# Altium schematic sheet Sheet1.SchDoc
size A
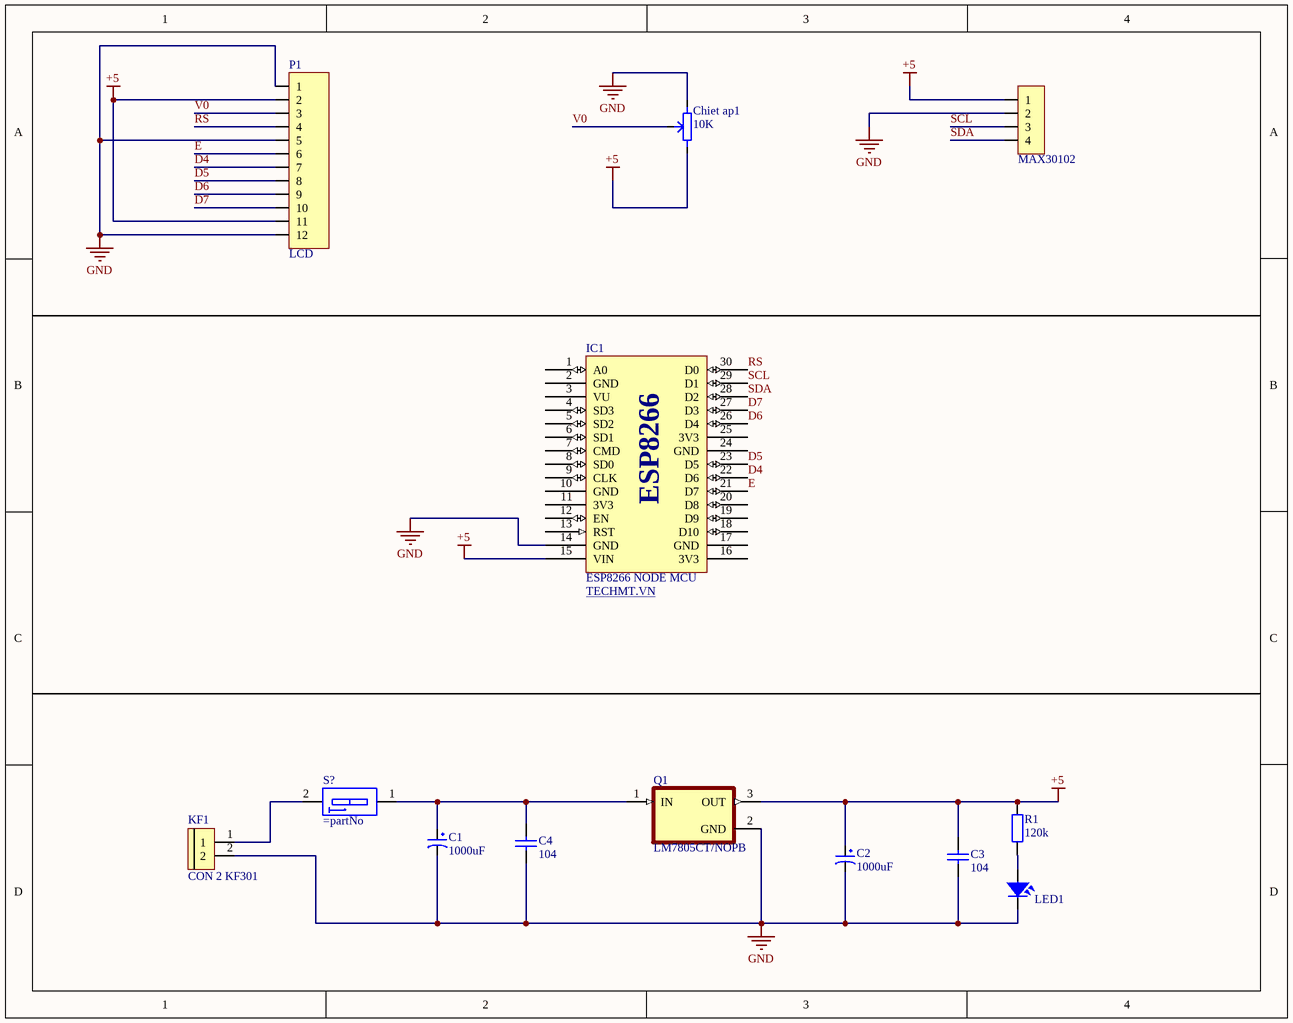
[diagram p0: Sheet1.SchDoc]

## Parts
C1  1000uF  [tu hoa 8mm]
C2  1000uF  [tu hoa 8mm]
C3  104  [tu gom]
C4  104  [tu gom]
Chiet_ap1  10K  [Bien Tro Tam Giac Dung]
IC1  ESP8266 NODE MCU  WEB: TECHMT.VN  [ESP8266 NodeMCU]
JP1  MAX30102  [JP 1x4 DT]
KF1  CON 2 KF301  [Con 2 KF301 5.08]
LED1  LED  [LED-3MM-YELLOW]  (value not drawn)
P1  LCD  [HDR/Header/12]
Q1  LM7805CT/NOPB  [TO254P1054X470X2600-3]
R1  120k  [tro vach 1/4w]
S?  (no value)  [SW-DIP1]

## Nets
+5: C2.1 C3.1 Chiet_ap1.1 IC1.15(VIN) JP1.1 P1.2 P1.11 Q1.3(OUT) R1.2
GND: C1.2 C2.2 C3.2 C4.2 Chiet_ap1.3 IC1.14(GND) JP1.2 KF1.2 LED1.2 P1.1 P1.5 P1.12 Q1.2(GND)
D4: IC1.22(D6) P1.7
D5: IC1.23(D5) P1.8
D6: IC1.26(D4) P1.9
D7: IC1.27(D3) P1.10
E: IC1.21(D7) P1.6
RS: IC1.30(D0) P1.4
SCL: IC1.29(D1) JP1.3
SDA: IC1.28(D2) JP1.4
V0: Chiet_ap1.2 P1.3
NetC1_1: C1.1 C4.1 Q1.1(IN) S?.1
NetKF1_1: KF1.1 S?.2
NetLED1_1: LED1.1 R1.1

Not connected (* = marked no-connect by the designer): IC1 1(A0) 2(GND) 3(VU) 4(SD3) 5(SD2) 6(SD1) 7(CMD) 8(SD0) 9(CLK) 10(GND) 11(3V3) 12(EN) 13(RST) 16(3V3) 17(GND) 18(D10) 19(D9) 20(D8) 24(GND) 25(3V3)

## Notes on the sheet
- (in symbol ESP8266 NodeMCU) ESP8266

## Library data of the parts
C1 C2 = Tu Hoa 1000uF 16V 8x20: Cắm; Don_Vi: Con; So_Chan: 2; Ten_Linh_Kien: Tụ Hóa 1000uF 16V 8x20MM; Ma_Hang: MH008300; Chung_Loai: Cắm; Kieu_Chan: *
C3 C4 = Tu gom 104 50V: Cắm; So_Chan: 2; Ten_Linh_Kien: Tụ gốm 104 100nF 50V; Don_Vi: Con; Ma_Hang: MH004761; Chung_Loai: Cắm; Kieu_Chan: *
Chiet_ap1 = Bien tro tam giac 10K Dung: Cắm; Ma_Hang: MH000919; Don_Vi: Con; Ten_Linh_Kien: Biến Trở Tam Giác 103-10K RM065 (Chân Đứng); Chung_Loai: Cắm; Kieu_Chan: *
IC1 = ESP8266 NodeMCU: LUA-ESP8266 Wifi Module Techmt.vn
JP1 = JP 1x4 2.54 Duc Thang: Cắm; Ten_Linh_Kien: Jump Đơn Đực 2.54MM 1x40P Thẳng 11MM; Don_Vi: Con; Ma_Hang: MH000903; Ghi_Chu: *; Kieu_Chan: *; Chung_Loai: Cắm
KF1 = CON 2 KF301: Cắm; Ma_Hang: MH000987; Ten_Linh_Kien: CON 2 KF301-2P 5.08MM Xanh Dương; Chung_Loai: Cắm; Ghi_Chu: *; Kieu_Chan: *; Don_Vi: Con
LED1 = LED: LED Single colour Green and Red; Value: LED 3 ly Single Colour
P1 = Header 12: Header, 12-Pin
Q1 = LM7805CT/NOPB: Linear Voltage Regulator IC Positive Fixed 1 Output 1.5A TO-220-3; MF: ON Semiconductor; Purchase-URL: https://pricing.snapeda.com/search/part/LM7805CT/?ref=eda; Check_prices: https://www.snapeda.com/parts/LM7805CT/Onsemi/view-part/?ref=eda; SnapEDA_Link: https://www.snapeda.com/parts/LM7805CT/Onsemi/view-part/?ref=snap; Price: None; Availability: In Stock; Package: TO-220-3 ON Semiconductor; MP: LM7805CT; Value: *
R1 = Tro Vach 1/4W 1%  120k: Cắm; Don_Vi: Con; Ten_Linh_Kien: Trở Vạch 1/4W 1% 120k; So_Chan: 2; Ma_Hang: MH008833; Chung_Loai: Cắm; Kieu_Chan: *
S? = SWDIP1: WS-DITV 2.54 mm small compact THT flat actuator with top tape; Manufacturer: Wurth Elektronik; Part No.: 418127160901; ComponentLink1 Description: Manufacturer; ComponentLink2 Description: Datasheet; Pole: 01; Created Date: Dec.2015; ComponentLink1URL: http://www.we-online.com; ComponentLink2URL: http://katalog.we-online.de/em/datasheet/4181271609xx.pdf; Created by: Baojun Chen